# Altium project Circuit design.PrjPcb
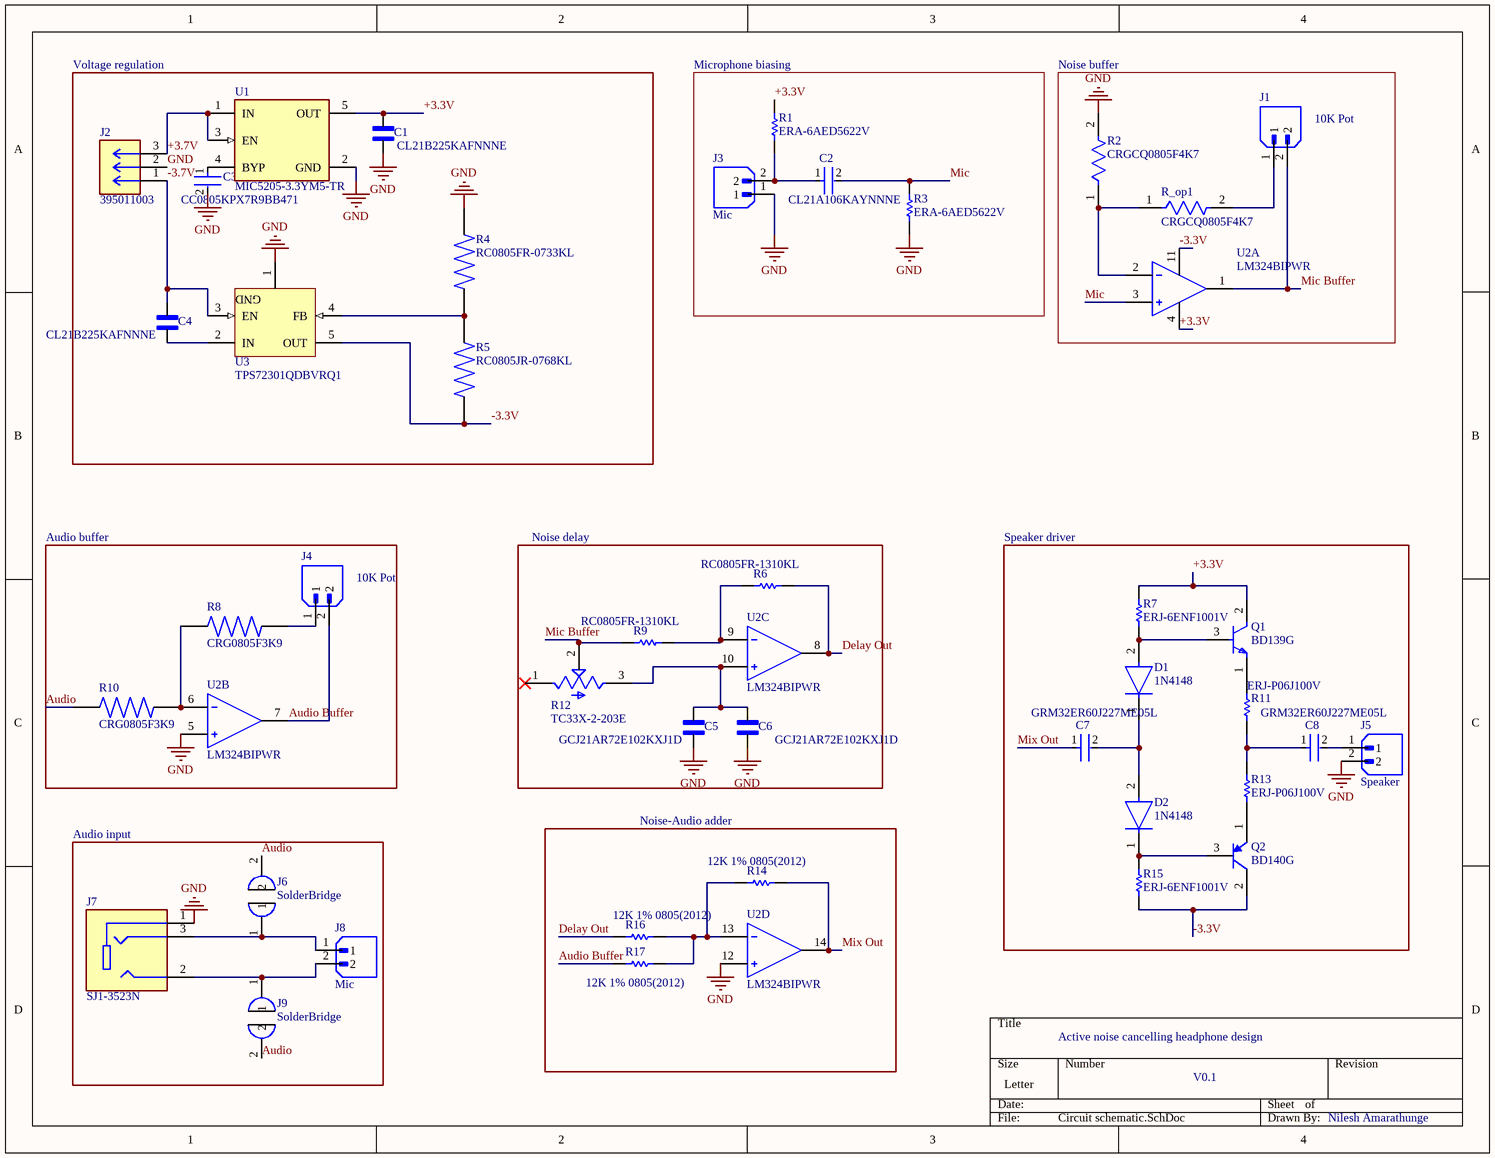
[diagram p0: Circuit schematic.SchDoc]
1 sheet, 42 parts. Net scope: global (net labels, ports and power ports of the same name join across sheets).
Board file: PCB.PcbDoc

## Sheet Circuit schematic.SchDoc
size Letter; SheetNumber: 1; SheetTotal: 1

### Parts
C1  CL21B225KAFNNNE  [CAPC2012X135N]
C2  CL21A106KAYNNNE  [FP-CL21-IPC_A]
C3  CC0805KPX7R9BB471  [FP-CC0805-0_85-MFG]
C4  CL21B225KAFNNNE  [CAPC2012X135N]
C5  GCJ21AR72E102KXJ1D  [CAPC2012X135N]
C6  GCJ21AR72E102KXJ1D  [CAPC2012X135N]
C7  GRM32ER60J227ME05L  [FP-GRM32E-0_3-MFG]
C8  GRM32ER60J227ME05L  [FP-GRM32E-0_3-MFG]
D1  1N4148  [FP-017AG-MFG]
D2  1N4148  [FP-017AG-MFG]
J1  10K Pot  [JST_B2B-XH-A]
J2  395011003  [CONN_39501-1003_MOL]
J3  Mic  [JST_B2B-XH-A]
J4  10K Pot  [JST_B2B-XH-A]
J5  Speaker  [JST_B2B-XH-A]
J6  SolderBridge  [PCBComponent_1]
J7  SJ1-3523N  [CUI_SJ1-3523N]
J8  Mic  [JST_B2B-XH-A]
J9  SolderBridge  [PCBComponent_1]
Q1  BD139G  [FP-77-09-MFG]
Q2  BD140G  [ONSC-TO-225-3-77-09]
R1  ERA-6AED5622V  [RESC2013X60X40LL20T25]
R2  CRGCQ0805F4K7  [FP-CRGCQ0805-IPC_C]
R3  ERA-6AED5622V  [RESC2013X60X40LL20T25]
R4  RC0805FR-0733KL  [RESC2012X60N]
R5  RC0805JR-0768KL  [RESC2012X60N]
R6  RC0805FR-1310KL  [RESC2013X60X35ML10T20]
R7  ERJ-6ENF1001V  [RESC2013X70X40ML20T20]
R8  CRG0805F3K9  [RESC2012X65N]
R9  RC0805FR-1310KL  [RESC2013X60X35ML10T20]
R10  CRG0805F3K9  [RESC2012X65N]
R11  ERJ-P06J100V  [RESC2013X70X40NL20T20]
R12  TC33X-2-203E  [TRIM_TC33X-2-203E]
R13  ERJ-P06J100V  [RESC2013X70X40NL20T20]
R14  12K 1% 0805(2012)  [RESC0805(2012)_L]
R15  ERJ-6ENF1001V  [RESC2013X70X40ML20T20]
R16  12K 1% 0805(2012)  [RESC0805(2012)_L]
R17  12K 1% 0805(2012)  [RESC0805(2012)_L]
R_op1  CRGCQ0805F4K7  [FP-CRGCQ0805-IPC_C]
U1  MIC5205-3.3YM5-TR  [FP-M5-MFG]
U2  LM324BIPWR  [FP-PW0014A-MFG]  (parts A,B,C,D of 4)
U3  TPS72301QDBVRQ1  [DBV0005A_N]

### Blocks framed on the sheet
Voltage regulation: C1 C3 C4 J2 R4 R5 U1 U3
Microphone biasing: C2 J3 R1 R3
Noise buffer: J1 R2 R_op1 U2
Audio buffer: J4 R8 R10 U2
Noise delay: C5 C6 R6 R9 R12 U2
Speaker driver: C7 C8 D1 D2 J5 Q1 Q2 R7 R11 R13 R15
Audio input: J6-J9
Noise-Audio adder: R14 R16 R17 U2

### Nets
GND: C1.1 C3.2 C5.1 C6.1 J2.2 J3.1 J5.2 J7.1 R2.2 R3.1 R4.1 U1.2(GND) U2.5(2IN+) U2.12(4IN+) U3.1(GND)
+3.3V: C1.2 Q1.2(C) R1.2 R7.2 U1.5(OUT) U2.4(VCC+)
+3.7V: J2.3 U1.1(IN) U1.3(EN)
-3.3V: Q2.2(C) R5.2 R15.1 U2.11(VCC-) U3.5(OUT)
-3.7V: C4.2 J2.1 U3.3(EN)
Audio: J6.2 J9.2 R10.1
Audio Buffer: J4.2 R17.1 U2.7(2OUT)
Delay Out: R6.2 R16.1 U2.8(3OUT)
Mic: C2.2 R3.2 U2.3(1IN+)
Mic Buffer: J1.2 R9.1 R12.2(W) U2.1(1OUT)
Mix Out: C7.1 R14.2 U2.14(4OUT)
NetC2_1: C2.1 J3.2 R1.1
NetC3_1: C3.1 U1.4(BYP)
NetC4_1: C4.1 U3.2(IN)
NetC5_2: C5.2 C6.2 R12.3(CW) U2.10(3IN+)
NetC7_2: C7.2 D1.1(C) D2.2(A)
NetC8_1: C8.1 R11.1 R13.2
NetC8_2: C8.2 J5.1
NetD1_2: D1.2(A) Q1.3(B) R7.1
NetD2_1: D2.1(C) Q2.3(B) R15.2
NetJ1_1: J1.1 R_op1.2
NetJ4_1: J4.1 R8.2
NetJ6_1: J6.1 J7.3 J8.1
NetJ7_2: J7.2 J8.2 J9.1
NetQ1_1: Q1.1(E) R11.2
NetQ2_1: Q2.1(E) R13.1
NetR2_1: R2.1 R_op1.1 U2.2(1IN-)
NetR4_2: R4.2 R5.1 U3.4(FB)
NetR6_1: R6.1 R9.2 U2.9(3IN-)
NetR8_1: R8.1 R10.2 U2.6(2IN-)
NetR14_1: R14.1 R16.2 R17.2 U2.13(4IN-)

Not connected (* = marked no-connect by the designer): R12 1(CCW)*

### Notes on the sheet
- Active noise cancelling headphone design
- V0.1
- Nilesh Amarathunge

### Library data of the parts
C1 C4 = CL21B225KAFNNNE: 2.2 ÂµF Â±10% 25V Ceramic Capacitor X7R 0805 (2012 Metric); MF: Samsung; SnapEDA_Link: https://www.snapeda.com/parts/CL21B225KAFNNNE/Samsung/view-part/?ref=snap; Package: SMD-2 Samsung; Value: *; MP: CL21B225KAFNNNE; Check_prices: https://www.snapeda.com/parts/CL21B225KAFNNNE/Samsung/view-part/?ref=eda; LCSC part #: C19110
C2 = CMP-13271-002975-1: CL21 Series 0805 10uF 25V ±10% Tolerance X5R Multilayer Ceramic Chip Capacitor; Case Code (Imperial): 0805; Length: 2mm; Case/Package: 0805; Packaging: Tape and Reel; Width: 0.049inch; Tolerance: 10%; Mount: Surface Mount; Min Operating Temperature: -55°C; Thickness: 0.057inch; Height: 1.25mm; Dielectric: X5R; Package Quantity: 1; Depth: 1.25mm; Capacitance: 10uF; Voltage Rating: 25V; Case Code (Metric): 2012; Max Operating Temperature: 85°C; Radiation Hardening: No; LCSC part #: C15850
C3 = CMP-03422-001305-1: CC0805 470 pF X7R 10.00% 50 V; Manufacturer: Yageo; Material: Ceramic; Value: 470 pF; Tolerance: 0.1; Voltage Rating: 50 V; Octopart: https://octopart.com/cc0805kpx7r9bb471-yageo-88496836; Footprint Url: http://www.yageo.com/exep/pages/download/literatures/UPY-C_GEN_24.pdf; Temperature Range Low: -30°C; RoHS: TRUE; Device Class L3: Ceramic Capacitors; Height: 0.95mm; Category: Cap; ComponentLink2Description: Datasheet; Device Class L1: Passive Components; Temperature Range High: +85°C; Package: CC0805-0.85; ComponentLink2URL: http://www.yageo.com/documents/recent/UPY-GPHC_Y5V_6.3V-to-50V_8.pdf; Device Class L2: Capacitors; Ipc Land Pattern Name: CAPC200125X85; Manufacturer Part Number: CC0805KPX7R9BB471; Mouser Description: Multilayer Ceramic Capacitors MLCC - SMD/SMT 470pF 50V X7R 10%; Capacitance: 470 pF; Temperature: -30°C to +85°C; Automotive: No; Lead Free: Yes; Temperature Characteristic: X7R; LCSC part #: C437474
C5 C6 = CL21B225KAFNNNE: 1nF Ceramic Capacitor X7R 0805 (2012 Metric); MF: Samsung; SnapEDA_Link: https://www.snapeda.com/parts/CL21B225KAFNNNE/Samsung/view-part/?ref=snap; Package: SMD-2 Samsung; Value: *; MP: CL21B225KAFNNNE; Check_prices: https://www.snapeda.com/parts/CL21B225KAFNNNE/Samsung/view-part/?ref=eda; LCSC part #: C437424
C7 C8 = CMP-06035-024340-1: Chip Multilayer Ceramic Capacitors for General Purpose, 1210, 220uF, X5R, 15%, 20%, 6.3V; Capacitance: 220uF; Length: 3.2mm; Voltage Rating (DC): 6.3V; Width: 2.5mm; Thickness: 2.5mm; Tolerance: 20%; Dielectric: X5R; LCSC part #: C469553
D1 D2 = CMP-07163-000046-1: DIODE GEN PURP 100V 200MA DO35; Forward Voltage: 1V; Max Power Dissipation: 500mW; Max Reverse Current: 5uA; Forward Current: 300mA; Current: 4A; Reverse Recovery Time: 4ns; Element Configuration: Single; Outside Diameter: 1.85mm; Capacitance: 4pF; Polarity: Standard; Max Forward Surge Current (Ifsm): 1A; Reverse Voltage: 100V; Output Current: 200mA; Average Rectified Current: 200mA; Diameter: 1.91mm; Max Repetitive Reverse Voltage (Vrrm): 100V; Current Rating: 200mA; Case/Package: DO-35; Lead Free: Lead Free; Number of Pins: 2; Recovery Time: 4ns; Packaging: Bulk; Contact Plating: Tin; Voltage: 100V; Mount: Through Hole; Max Surge Current: 4A; Package Quantity: 2000; Width: 1.91mm; Max Reverse Voltage (DC): 100V; Length: 4.56mm; Radiation Hardening: No; Power Dissipation: 500mW; Voltage Rating (DC): 100V; Peak Non-Repetitive Surge Current: 4A; REACH SVHC: No SVHC; Height: 4.56mm; Max Operating Temperature: 175°C; Series: -; Weight: 0.01lb; Min Operating Temperature: -65°C
J1 J3-J5 J8 = B2B-XH-A: MF: {'manufacturer': u'JST Sales America Inc.'}; Package: None; Price: None; Value: *; MP: B2B-XH-A; Availability: Unavailable
J7 = SJ1-3523N: 3.5 mm, Stereo, Right Angle, Through Hole, 3 Conductors, 0 Internal Switches, Audio Jack Connector; MF: Same Sky; SnapEDA_Link: https://www.snapeda.com/parts/SJ1-3523N/Same+Sky/view-part/?ref=snap; Package: None; Value: *; MP: SJ1-3523N; Check_prices: https://www.snapeda.com/parts/SJ1-3523N/Same+Sky/view-part/?ref=eda; LCSC part #: C20182914
Q1 = CMP-1048-01269-2: NexarPartId: 354669; Manufacturer Lifecycle Status: ACTIVE; Collector Emitter Saturation Voltage: 500mV; Collector Emitter Breakdown Voltage: 80V; hFE Min: 25; Element Configuration: Single; Max Power Dissipation: 1.25W; Max Junction Temperature (Tj): 150°C; Emitter Base Voltage (VEBO): 5V; Max Collector Current: 1.5A; Number of Elements: 1; Polarity: NPN; Min Operating Temperature: -55°C; Max Operating Temperature: 150°C; Voltage Rating (DC): 80V; REACH SVHC: No SVHC; Radiation Hardening: No; Contact Plating: Tin; Schedule B: 8541290080, 8541290080; Number of Pins: 3; Case/Package: TO-225; Lifecycle Status: Production; Collector Base Voltage (VCBO): 80V; Weight: 4.535924g; Height: 11.04mm; RoHS: Compliant; Width: 2.66mm; Collector Emitter Voltage (VCEO): 80V; Lead Free: Lead Free; Current Rating: 1.5A; Power Dissipation: 1.25W; Packaging: Bulk; Length: 7.74mm
Q2 = CMP-1048-01270-1: Plastic Medium-Power Silicon PNP Transistor, 3-Pin TO-225, Pb-Free, Bulk Box; Manufacturer: On Semiconductor; IC Continuous (A): 1.5; PartNumber: BD140G; PackageVersion: Rev. AC, 12/2013; ComponentLink1URL: http://www.onsemi.com/; Packing: Bulk Box; ComponentLink1Description: Manufacturer URL; ComponentLink2URL: http://www.onsemi.com/pub_link/Collateral/BD136-D.PDF; ComponentLink3Description: Package Specification; Polarity: PNP; PackageReference: TO-225-3-77-09; ComponentLink3URL: http://www.onsemi.com/pub_link/Collateral/77-09.PDF; Mounting Technology: Through Hole; PackageDescription: 3-Pin Flange Mount, Vertical Straight Lead, Body 7.6 x 2.7 mm, Pitch 2.29 mm; DatasheetVersion: Rev. 15; RoHS: TRUE; ComponentLink2Description: Datasheet
R1 R3 = CMP-2001-00694-1: Manufacturer: Panasonic; Part Number: ERA-6AED5622V; LCSC part #: C445652
R2 R_op1 = CMP-03211-010668-1: CRGCQ0805 4.7KΩ 0.125W ±100ppm/°C 1% 150V; Manufacturer: TE Connectivity; Automotive Grade: Grade 837; Tolerance: 0.01; Series: CRGCQ; ComponentLink2Description: Datasheet; Voltage Rating: 150V; Temperature Range High: +155°C; Manufacturer Part Number: CRGCQ0805F4K7; Height: 0.65mm; RoHS: TRUE; Ipc Land Pattern Name: RESC200125X55; Ambient Temperature Range High: +70°C; Device Class L3: Chip SMD Resistors; Composition: Thick Film; ComponentLink2URL: https://www.te.com/commerce/DocumentDelivery/DDEController?Action=showdoc&DocId=Data+Sheet%7F1773204-3%7F1%7Fpdf%7FEnglish%7FENG_DS_1773204-3_1.pdf%7F4-2176341-846; Temperature Range Low: -55°C; Temperature Coefficient: ±100ppm/°C; Automotive: Yes; Resistance: 4.7KΩ; Package: CRGCQ0805; Value: 4.7KΩ; Device Class L2: Resistors; Octopart: https://octopart.com/crgcq0805f4k7-te+connectivity-91018183; Power Rating: 0.125W; Device Class L1: Passive Components; Temperature: -55°C to +155°C; Category: Res; Lead Free: Yes; LCSC part #: C336873
R4 = RC0805FR-0733KL: 33 kOhms Â±1% 0.125W, 1/8W Chip Resistor 0805 (2012 Metric) Moisture Resistant Thick Film; MF: Yageo; SnapEDA_Link: https://www.snapeda.com/parts/RC0805FR-0733KL/Yageo/view-part/?ref=snap; Package: 2012 Yageo; Value: *; MP: RC0805FR-0733KL; Check_prices: https://www.snapeda.com/parts/RC0805FR-0733KL/Yageo/view-part/?ref=eda; LCSC part #: C141696
R5 = RC0805JR-0768KL: 68 kOhms Â±5% 0.125W, 1/8W Chip Resistor 0805 (2012 Metric) Moisture Resistant Thick Film; MF: Yageo; SnapEDA_Link: https://www.snapeda.com/parts/RC0805JR-0768KL/Yageo/view-part/?ref=snap; Package: 2012 Yageo; Value: *; MP: RC0805JR-0768KL; Check_prices: https://www.snapeda.com/parts/RC0805JR-0768KL/Yageo/view-part/?ref=eda; LCSC part #: C137412
R6 R9 = CMP-2001-04513-1: Manufacturer: Yageo; Part Number: RC0805FR-1310KL; LCSC part #: C191101
R7 R15 = CMP-2001-04375-5: Chip Resistor, 1 KOhm, +/- 1%, 0.125 W, -55 to 155 degC, 0805 (2012 Metric), RoHS, Tape and Reel; Manufacturer: Panasonic; Voltage Rating: 150 V; ComponentLink1URL: http://www.panasonic.com/; ComponentLink2Description: Datasheet; REACH SVHC: Yes; ComponentLink1Description: Manufacturer URL; Length: 2 mm; Height: 0.6 mm; Package Quantity: 1; PackageDescription: 2-Pin Surface Mount Device, Body 2 x 1.25 mm; Packaging: Cut Tape; PackageReference: 0805; Max Operating Temperature: 155 degC; Mounting Technology: Surface Mount; ComponentLink2URL: http://industrial.panasonic.com/cdbs/www-data/pdf/RDA0000/AOA0000C86.pdf; DatasheetVersion: 04/2015; Min Operating Temperature: -55 degC; RoHSCompliant: true; Mount: Surface Mount; LCSC part #: C79496
R8 R10 = CRG0805F3K9: CRG0805 1% 3K9; Package: None; Price: None; Value: *; MP: CRG0805F3K9; Availability: Unavailable; LCSC part #: C473293
R11 R13 = CMP-2001-00475-1: Manufacturer: Panasonic; Part Number: ERJ-P06J100V; LCSC part #: C6614492
R12 = TC33X-2-203E: 20 kOhms 0.1W, 1/10W J Lead Surface Mount Trimmer Potentiometer Cermet 1 Turn Top Adjustment; MF: Bourns; Value: *; SnapEDA_Link: https://www.snapeda.com/parts/TC33X-2-203E/Bourns/view-part/312812/?ref=snap; Check_prices: https://www.snapeda.com/parts/TC33X-2-203E/Bourns/view-part/312812/?ref=eda; Digi-Key_Part_Number: TC33X-2-203ECT-ND; Purchase-URL: https://pricing.snapeda.com/search/part/TC33X-2-203E/?ref=eda; Package: 1608 Bourns; MP: TC33X-2-203E; LCSC part #: C720648
R14 R16 R17 = CMP-1013-00631-1: 12K 0.125W 1% 0805 (2012 Metric)  SMD; Case-Metric: 2012; Case-EIA: 0805; Value: 12000.00 Ohm; Technology: SMT; Tolerance: 1 %; Power: 0.125 W; LCSC part #: C413717
U1 = CMP-06324-000014-1: IC REG LINEAR 3.3V 150MA SOT23-5; Manufacturer: Microchip; Number Of Outputs: 1; Output Type: Fixed; Min Supply Voltage: 2.5V; Accuracy Percentage: 2%; Dropout Voltage: 165mV; Max Supply Voltage: 16V; Max Junction Temp: +125°C; Standoff Height: 0mm; Digikey Description: IC REG LINEAR 3.3V 150MA SOT23-5; Output Current: 150mA; Temperature: -40°C to +125°C; Temperature Range High: +125°C; Height: 1.45mm; ComponentLink2URL: http://ww1.microchip.com/downloads/en/DeviceDoc/20005785A.pdf; Mouser Description: LDO Voltage Regulators; Device Class L3: Voltage Regulators - Linear; Package: M5; Temperature Range Low: -40°C; Device Class L1: Integrated Circuits (ICs); ComponentLink2Description: Datasheet; Automotive: No; Ipc Land Pattern Name: SOT95P280X118-5; Octopart: https://octopart.com/mic5205-3.3ym5-tr-microchip-66802130; Device Class L2: Power Management ICs; Manufacturer Part Number: MIC5205-3.3YM5-TR; Lead Free: Yes; RoHS: TRUE; LCSC part #: C37970
U2 = CMP-00370-131314463-1: LM324BIPWR Quad, 36-V, 1.2-MHz 3-mV offset voltage operational amplifier 14-TSSOP -40 to 85; Manufacturer Lifecycle Status: ACTIVE; Number of Pins: 14; NexarPartId: 131314463; Height: 1.2mm; Thickness: 1mm; Length: 5mm; Lifecycle Status: Production; Width: 4.4mm; Case/Package: TSSOP; LCSC part #: C5214225
U3 = CMP-0394-00323-2: Single Output High PSRR LDO, 200 mA, Adjustable -10 to -1.2 V Output, -10 to -2.7 V Input, 5-pin SOT-23 (DBV), -40 to 125 degC, Green (RoHS & no Sb/Br); Manufacturer: Texas Instruments; SubFamily: Single Channel LDO; Vdo(Typ)(mV): 280; Accuracy(%): 2; Iout(Max)(A): 0.2; Iq(Typ)(mA): 0.13; Vout Adj(Max)(V): -1.2; Vin(Max)(V): -2.7; PartNumber: TPS72301QDBVRQ1; Vin(Min)(V): -10; ComponentLink3URL: http://www.ti.com/litv/pdf/mpds018i; DatasheetVersion: SLVSAJ4B; Vout Adj(Min)(V): -10; ComponentLink2Description: Datasheet; ComponentLink1URL: http://www.ti.com/; PackageReference: DBV0005A; PackageDescription: 5-Pin Plastic Small Outline, Body 1.60 Ãƒâ€” 2.90 mm, Pitch 0.95 mm; Mounting Technology: Surface Mount; ComponentLink3Description: Package Specification; Eco-Plan: Green (RoHS & no Sb/Br); ComponentLink1Description: Manufacturer URL; ComponentLink2URL: http://www.ti.com/general/docs/lit/getliterature.tsp?genericPartNumber=TPS72301-Q1&fileType=pdf; PackageVersion: 4073253-4/K; Code_JEDEC: MO-178; LCSC part #: C2861780
J2 = 395011003: Package: None; Price: None; Value: *; MP: 395011003; Availability: Unavailable